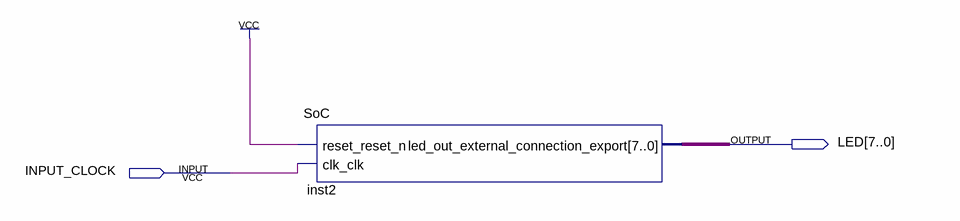
[diagram p0: schematic sheet]
// Quartus schematic TopLevel.bdf as structural Verilog: 1 symbols, 2 pins
module TopLevel (
  input  INPUT_CLOCK,
  output [7:0] LED
);

  SoC inst2 (.reset_reset_n(1'b1), .clk_clk(INPUT_CLOCK), .led_out_external_connection_export(LED));
endmodule
